# Altium schematic sheet ov7670电路（骑飞）.SchDoc
size A4
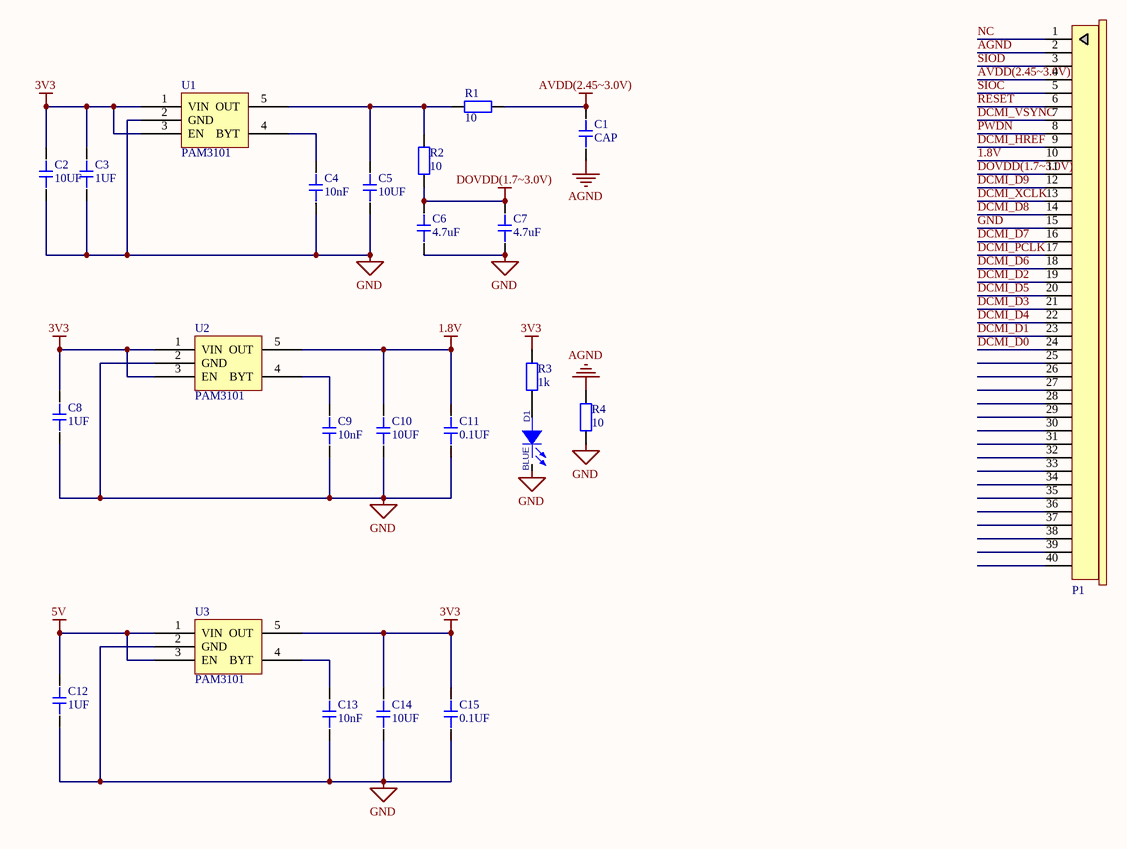
[diagram p0: ov7670电路（骑飞）.SchDoc]

## Parts
C1  CAP  [C_0603]
C2  10UF  [C_0805]
C3  1UF  [C_0603]
C4  10nF  [C_0603]
C5  10UF  [C_0805]
C6  4.7uF  [C_0805]
C7  4.7uF  [C_0603]
C8  1UF  [C_0603]
C9  10nF  [C_0603]
C10  10UF  [C_0805]
C11  0.1UF  [C_0603]
C12  1UF  [C_0603]
C13  10nF  [C_0603]
C14  10UF  [C_0805]
C15  0.1UF  [C_0603]
D1  value BLUE  [LED_0603]  (hidden comment: LED)
P1  FPC  [FPC0.5-40P-A]  (value not drawn)
R1  value 10  [0603-1]  (hidden comment: Res1)
R2  value 10  [0603-1]  (hidden comment: Res1)
R3  value 1k  [0603-1]  (hidden comment: Res1)
R4  value 10  [0603-1]  (hidden comment: Res1)
U1  PAM3101  [SOT23-5]
U2  PAM3101  [SOT23-5]
U3  PAM3101  [SOT23-5]

## Nets
1.8V: C10.2 C11.2 P1.10 U2.5(OUT)
3V3: C2.2 C3.2 C8.2 C14.2 C15.2 R3.2 U1.1(VIN) U1.3(EN) U2.1(VIN) U2.3(EN) U3.5(OUT)
5V: C12.2 U3.1(VIN) U3.3(EN)
AGND: C1.1 P1.2 R4.2
AVDD(2.45~3.0V): C1.2 P1.4 R1.2
DOVDD(1.7~3.0V): C6.2 C7.2 P1.11 R2.1
GND: C2.1 C3.1 C4.1 C5.1 C6.1 C7.1 C8.1 C9.1 C10.1 C11.1 C12.1 C13.1 C14.1 C15.1 D1.2(CATHODE) P1.15 R4.1 U1.2(GND) U2.2(GND) U3.2(GND)
DCMI_D0: P1.24
DCMI_D1: P1.23
DCMI_D2: P1.19
DCMI_D3: P1.21
DCMI_D4: P1.22
DCMI_D5: P1.20
DCMI_D6: P1.18
DCMI_D7: P1.16
DCMI_D8: P1.14
DCMI_D9: P1.12
DCMI_HREF: P1.9
DCMI_PCLK: P1.17
DCMI_VSYNC: P1.7
DCMI_XCLK: P1.13
NC: P1.1
PWDN: P1.8
RESET: P1.6
SIOC: P1.5
SIOD: P1.3
NetC4_2: C4.2 U1.4(BYT)
NetC5_2: C5.2 R1.1 R2.2 U1.5(OUT)
NetC9_2: C9.2 U2.4(BYT)
NetC13_2: C13.2 U3.4(BYT)
NetD1_1: D1.1(ANODE) R3.1

Not connected (* = marked no-connect by the designer): P1 25 26 27 28 29 30 31 32 33 34 35 36 37 38 39 40

## Library data of the parts
C2-C15 = CAP
P1 = FPC-40P: FPC排线连接器
R1-R4 = Res1: 贴片电阻; Published: 8-Jun-2000; LatestRevisionDate: 17-Jul-2002; LatestRevisionNote: Re-released for DXP Platform.; PackageReference: AXIAL-0.4; Publisher: Altium Limited
U1-U3 = PAM3101: LDO
D1 = LED: PCB DECAL: LED_0603